# Altium schematic sheet Digital Inputs.SchDoc: RB25DET - Digital Inputs
size A4; Address1: Drawn By:; Address2: Dan Visser; DocumentNumber: A; Revision: 0.1; SheetNumber: 6; SheetTotal: 12
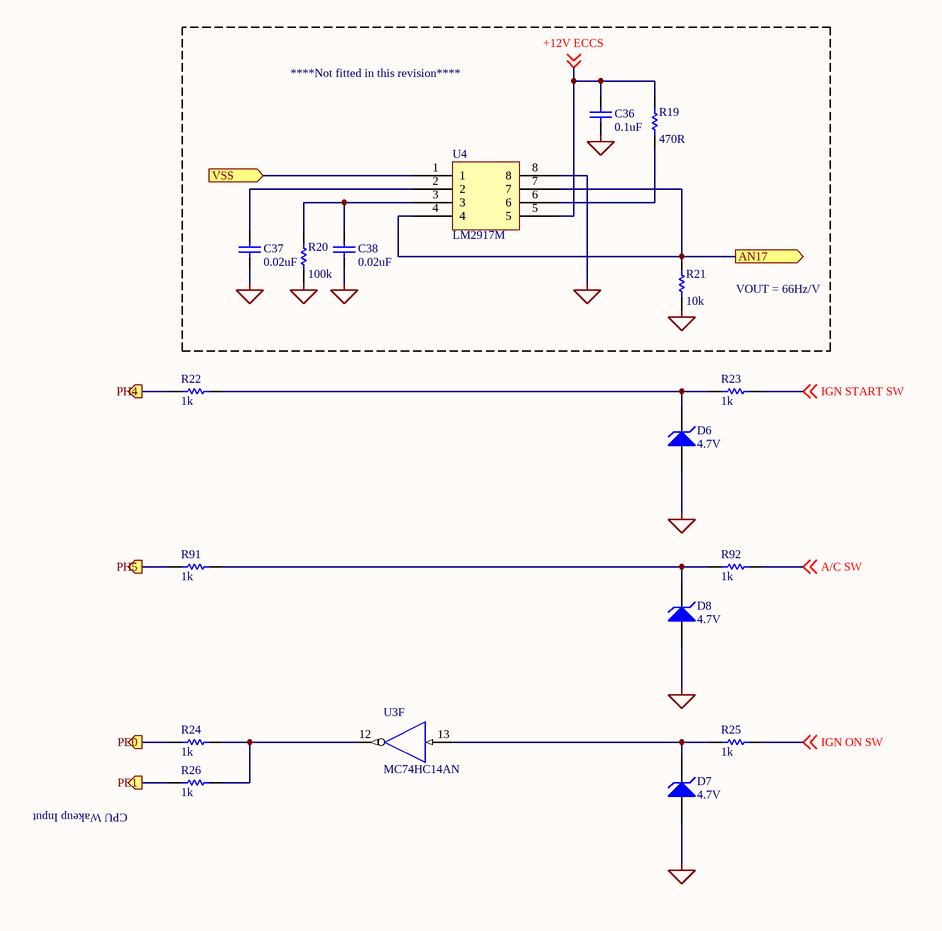
[diagram p0: Digital Inputs.SchDoc]

## Parts
C36  value 0.1uF  [RAD-0.3]
C37  value 0.02uF  [RAD-0.3]
C38  value 0.02uF  [RAD-0.3]
D6  4.7V  [DIODE-0.7]
D7  4.7V  [DIODE-0.7]
D8  4.7V  [DIODE-0.7]
R19  value 470R  [AXIAL-0.3]
R20  value 100k  [AXIAL-0.3]
R21  value 10k  [AXIAL-0.3]
R22  value 1k  [AXIAL-0.3]
R23  value 1k  [AXIAL-0.3]
R24  value 1k  [AXIAL-0.3]
R25  value 1k  [AXIAL-0.3]
R26  value 1k  [AXIAL-0.3]
R91  value 1k  [AXIAL-0.3]
R92  value 1k  [AXIAL-0.3]
U3  MC74HC14AN  [646-06]  (part F of 6)
U4  LM2917M  [SOIC8N_N]

## Ports
AN17 (out), PE0 (out), PE1 (out), PH4 (out), PH5 (out), VSS (in)

## Nets
GND: U3.7(GND)
NetC36_1: C36.1 C37.1 C38.1 D6.1(A) D7.1(A) D8.1(A) R20.1 R21.1 U4.8
VDD: U3.14(VDD)
+12V ECCS: C36.2 R19.2 U4.5 ; off-sheet +12V ECCS
A/C SW: R92.2 ; off-sheet A/C SW
AN17: R21.2 U4.4 U4.7 ; port AN17
IGN ON SW: R25.2 ; off-sheet IGN ON SW
IGN START SW: R23.2 ; off-sheet IGN START SW
PE0: R24.2 ; port PE0
PE1: R26.2 ; port PE1
PH4: R22.2 ; port PH4
PH5: R91.2 ; port PH5
VSS: U4.1 ; port VSS
NetC37_2: C37.2 U4.2
NetC38_2: C38.2 R20.2 U4.3
NetD6_2: D6.2(K) R22.1 R23.1
NetD7_2: D7.2(K) R25.1 U3.13(A)
NetD8_2: D8.2(K) R91.1 R92.1
NetR19_1: R19.1 U4.6
NetR24_1: R24.1 R26.1 U3.12(Y)

## Notes on the sheet
- ****Not fitted in this revision****
- VOUT = 66Hz/V
- (near R26) CPU Wakeup Input
- Title
- Size:
- Date:
- A4
- Number:
- Time:
- Revision:
- Sheet
- of

## Library data of the parts
C36-C38 = Cap: Capacitor; Published: 8-Jun-2000; LatestRevisionDate: 17-Jul-2002; LatestRevisionNote: Re-released for DXP Platform.; PackageReference: RAD-0.3; Publisher: Altium Limited; PackageDescription: Radial Cap, Thru-Hole; 2 Leads; 0.3 in Pin Spacing
D6-D8 = D Zener: Zener Diode; Published: 8-Jun-2000; LatestRevisionDate: 17-Jul-2002; LatestRevisionNote: Re-released for DXP Platform.; PackageReference: DIODE-0.7; Publisher: Altium Limited; PackageDescription: Diode, Thru-Hole; 2 Leads; 0.7 in Pin Spacing
R19-R21 = res1: Resistor; Published: 8-Jun-2000; LatestRevisionDate: 17-Jul-2002; LatestRevisionNote: Re-released for DXP Platform.; PackageReference: AXIAL-0.3; Publisher: Altium Limited; PackageDescription: Axial Device, Thru-Hole; 2 Leads; 0.3 in Pin Spacing
R22-R26 R91 R92 = Res1: Resistor; Published: 8-Jun-2000; LatestRevisionDate: 17-Jul-2002; LatestRevisionNote: Re-released for DXP Platform.; PackageReference: AXIAL-0.3; Publisher: Altium Limited; PackageDescription: Axial Device, Thru-Hole; 2 Leads; 0.3 in Pin Spacing
U3 = MC74HC14AN: Hex Schmitt Trigger Inverter; Published: 17-Jul-2002; LatestRevisionDate: 06-Jun-2005; LatestRevisionNote: Stylized 3D Model Added; DatasheetVersion: 1989; PackageVersion: 1997; PackageReference: 646-06; Publisher: Altium Limited; PackageDescription: DIP; 14 Leads; Row Spacing 7.62 mm; Pitch 2.54 mm; ComponentLink1Description: Manufacturer Link; ComponentLink1URL: http://www.onsemi.com/site/products/parametrics/0,4446,247,00.html; ComponentLink2Description: Ibis Model; ComponentLink2URL: http://www.onsemi.com/pub/Collateral/MC54HC14AJ.IBS